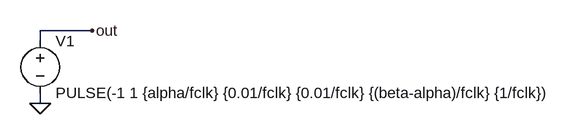
[diagram p0: schematic clk.asc]
clk.asc, the LTspice schematic file:
Version 4
SHEET 1 1192 680
WIRE 448 144 368 144
WIRE 368 160 368 144
WIRE 368 256 368 240
FLAG 448 144 out
FLAG 368 256 0
SYMBOL voltage 368 144 R0
WINDOW 123 0 0 Left 2
WINDOW 39 0 0 Left 2
SYMATTR InstName V1
SYMATTR Value PULSE(-1 1 {alpha/fclk} {0.01/fclk} {0.01/fclk} {(beta-alpha)/fclk} {1/fclk})

The netlist it stands for:
* clk.asc
V1 out 0 PULSE(-1 1 {alpha/fclk} {0.01/fclk} {0.01/fclk} {(beta-alpha)/fclk} {1/fclk})
.backanno
.end